# Altium schematic sheet Fuente V1.SchDoc
size A4; SheetNumber: 1; SheetTotal: 1
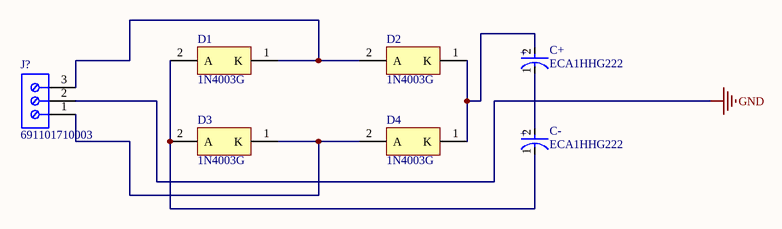
[diagram p0: Fuente V1.SchDoc]

## Parts
C+  ECA1HHG222  [FP-RAD-TH-D_16_0_5-L_31_5-MFG]
C-  ECA1HHG222  [FP-RAD-TH-D_16_0_5-L_31_5-MFG]
D1  1N4003G  [ONSC-AXIAL_LEAD-2-59-10_P]
D2  1N4003G  [ONSC-AXIAL_LEAD-2-59-10_P]
D3  1N4003G  [ONSC-AXIAL_LEAD-2-59-10_P]
D4  1N4003G  [ONSC-AXIAL_LEAD-2-59-10_P]
J?  691101710003  [691101710003]

## Nets
GND: J?.2
NetC+_1: C+.1(C) C-.2(A)
NetC+_2: C+.2(A) D2.1(K) D4.1(K)
NetC-_1: C-.1(C) D1.2(A) D3.2(A)
NetD1_1: D1.1(K) D2.2(A) J?.3
NetD3_1: D3.1(K) D4.2(A) J?.1

## Notes on the sheet
- (in symbol CMP-05427-001651-1) +

## Library data of the parts
C+ C- = CMP-05427-001651-1: Aluminum Electrolytic Capacitors (Radial Lead Type) AEC-Q200 Qualified 2200uF ±20% 50V; Leakage Current: 3uA; Ripple Current (AC): 1.47A; Capacitance: 2.2mF; Lead Diameter: 0.8mm; Lead/Base Style: Straight; Dissipation Factor: 0.14%; Life (Hours): 2000Hour; Mount: Through Hole; RoHS Compliant: Yes; Lead Pitch: 7.5mm; Package Quantity: 100; REACH SVHC: No SVHC; Height: 31.5mm; Case/Package: Radial; Contact Plating: Tin; Radiation Hardening: No; Termination: Radial; Construction: RADIAL; Diameter: 16mm; Tolerance: 20%; Series: NHG; Max Operating Temperature: 105°C; Voltage Rating: 50V; Length: 31.5mm; Height - Seated (Max): 1.319inch; Width: 16mm; Voltage Rating (DC): 50V; Min Operating Temperature: -55°C; Voltage: 50V; Packaging: Bulk; Number of Pins: 2; Ripple Current: 1.47A
D1-D4 = CMP-0902-00175-1: Standard Recovery Rectifier, 2-Pin Axial_Lead, Pb-Free, Bulk Bag; Manufacturer: On Semiconductor; IFSM Max (A): 30; IO(rec) Max (A): 1; VRRM Max (V): 200; DatasheetVersion: Rev. 13; ComponentLink1URL: http://www.onsemi.com/; Mounting Technology: Through Hole; PackageDescription: 2-Pin, Axial Lead, Diameter 2.35 mm; PartNumber: 1N4003G; PackageVersion: Rev. U, 02/2005; ComponentLink3Description: Package Specification; ComponentLink3URL: http://www.onsemi.cn/pub_link/Collateral/59-10.PDF; ComponentLink2Description: Datasheet; ComponentLink2URL: http://www.onsemi.com/pub_link/Collateral/1N4001-D.PDF; PackageReference: AXIAL_LEAD-2-59-10; Packing: Bulk Bag; RoHS: TRUE; Type: Standard Recovery; ComponentLink1Description: Manufacturer URL
J? = CMP-1502-03257-2: NexarPartId: 8917705; Voltage Rating: 250V; Current: 16A; Wire Gauge (Min): 14AWG; Pitch: 5.0038mm; Wire Gauge (Max): 26AWG; Number of Positions Per Level: 3; Plating: Steel; Number of Levels: 1; Stripping Length: -7mm; REACH SVHC: Unknown; Width: 16.2mm; Height: 16.4mm; Contact Material: Brass; RoHS: Compliant; Color: Blue; Contact Plating: Tin; Lead Pitch: 5mm; Packaging: Box; Termination: Screw; Number of Contacts: 3; Wire/Cable Gauge: 26AWG; Min Operating Temperature: -40°C; Max Operating Temperature: 105°C; Housing Material: Nylon; Length: 9mm; Voltage: 250V; Mount: Through Hole; Current Rating: 16A; Number of Pins: 3